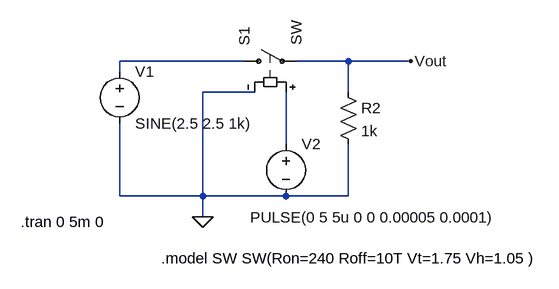
[diagram p0: schematic Llave.asc]
Llave.asc, the LTspice schematic file:
Version 4
SHEET 1 880 680
WIRE 0 128 -192 128
WIRE 160 128 80 128
WIRE 256 128 160 128
WIRE -192 144 -192 128
WIRE 16 176 -64 176
WIRE 160 176 160 128
WIRE 64 256 64 176
WIRE -192 336 -192 224
WIRE -64 336 -64 176
WIRE -64 336 -192 336
WIRE 64 336 -64 336
WIRE 160 336 160 256
WIRE 160 336 64 336
WIRE -64 368 -64 336
FLAG -64 368 0
FLAG 256 128 Vout
SYMBOL sw -16 128 R270
SYMATTR InstName S1
SYMBOL voltage -192 128 R0
WINDOW 123 0 0 Left 0
WINDOW 39 0 0 Left 0
SYMATTR InstName V1
SYMATTR Value SINE(2.5 2.5 1k)
SYMBOL voltage 64 240 R0
WINDOW 3 -55 129 Left 2
WINDOW 123 0 0 Left 0
WINDOW 39 0 0 Left 0
SYMATTR InstName V2
SYMATTR Value PULSE(0 5 5u 0 0 0.00005 0.0001)
SYMBOL res 144 160 R0
SYMATTR InstName R2
SYMATTR Value 1k
TEXT -344 376 Left 2 !.tran 0 5m 0
TEXT -128 432 Left 2 !.model SW SW(Ron=240 Roff=10T Vt=1.75 Vh=1.05 )

The netlist it stands for:
* Llave.asc
S1 N001 Vout N002 0 SW
V1 N001 0 SINE(2.5 2.5 1k)
V2 N002 0 PULSE(0 5 5u 0 0 0.00005 0.0001)
R2 Vout 0 1k
.tran 0 5m 0
.model SW SW(Ron=240 Roff=10T Vt=1.75 Vh=1.05 )
.backanno
.end